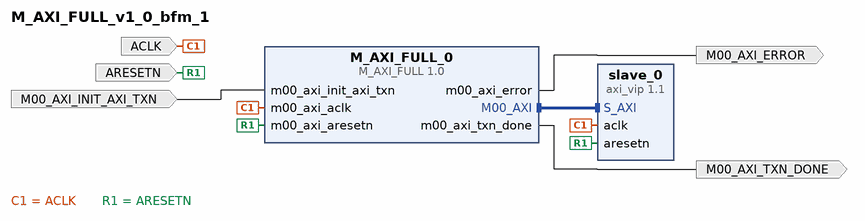
[diagram p0: block diagram of the top level]
# Vivado block design M_AXI_FULL_v1_0_bfm_1, xc7z020clg400-1, Vivado 2022.1
create_bd_design M_AXI_FULL_v1_0_bfm_1

create_bd_port -dir I -type clk ACLK
set_property -dict [list \
  CONFIG.ASSOCIATED_RESET ARESETN \
  CONFIG.CLK_DOMAIN M_AXI_FULL_v1_0_bfm_1_ACLK \
  CONFIG.FREQ_HZ 100000000 \
  CONFIG.PHASE 0.000 \
] [get_bd_ports ACLK]
create_bd_port -dir I -type rst ARESETN
set_property -dict {CONFIG.POLARITY ACTIVE_LOW} [get_bd_ports ARESETN]
create_bd_port -dir I M00_AXI_INIT_AXI_TXN
create_bd_port -dir O M00_AXI_ERROR
create_bd_port -dir O M00_AXI_TXN_DONE

create_bd_cell -type ip -vlnv xilinx.com:user:M_AXI_FULL:1.0 M_AXI_FULL_0
create_bd_cell -type ip -vlnv xilinx.com:ip:axi_vip:1.1 slave_0
set_property -dict {CONFIG.INTERFACE_MODE SLAVE CONFIG.PROTOCOL AXI4} [get_bd_cells slave_0]

# ---- connections ----

connect_bd_intf_net [get_bd_intf_pins slave_0/S_AXI] [get_bd_intf_pins M_AXI_FULL_0/M00_AXI]
connect_bd_net -net aclk_net [get_bd_ports ACLK] [get_bd_pins slave_0/aclk] [get_bd_pins M_AXI_FULL_0/m00_axi_aclk]
connect_bd_net -net aresetn_net [get_bd_ports ARESETN] [get_bd_pins slave_0/aresetn] [get_bd_pins M_AXI_FULL_0/m00_axi_aresetn]
connect_bd_net -net error_00 [get_bd_pins M_AXI_FULL_0/m00_axi_error] [get_bd_ports M00_AXI_ERROR]
connect_bd_net -net init_axi_txn_00 [get_bd_ports M00_AXI_INIT_AXI_TXN] [get_bd_pins M_AXI_FULL_0/m00_axi_init_axi_txn]
connect_bd_net -net txn_done_00 [get_bd_pins M_AXI_FULL_0/m00_axi_txn_done] [get_bd_ports M00_AXI_TXN_DONE]

# ---- address map ----
assign_bd_address -offset 0x44A00000 -range 64K -target_address_space [get_bd_addr_spaces M_AXI_FULL_0/M00_AXI] [get_bd_addr_segs slave_0/S_AXI/Reg]

validate_bd_design
save_bd_design
